# Altium project LaserLider.PrjPcb (part 1 of 3)
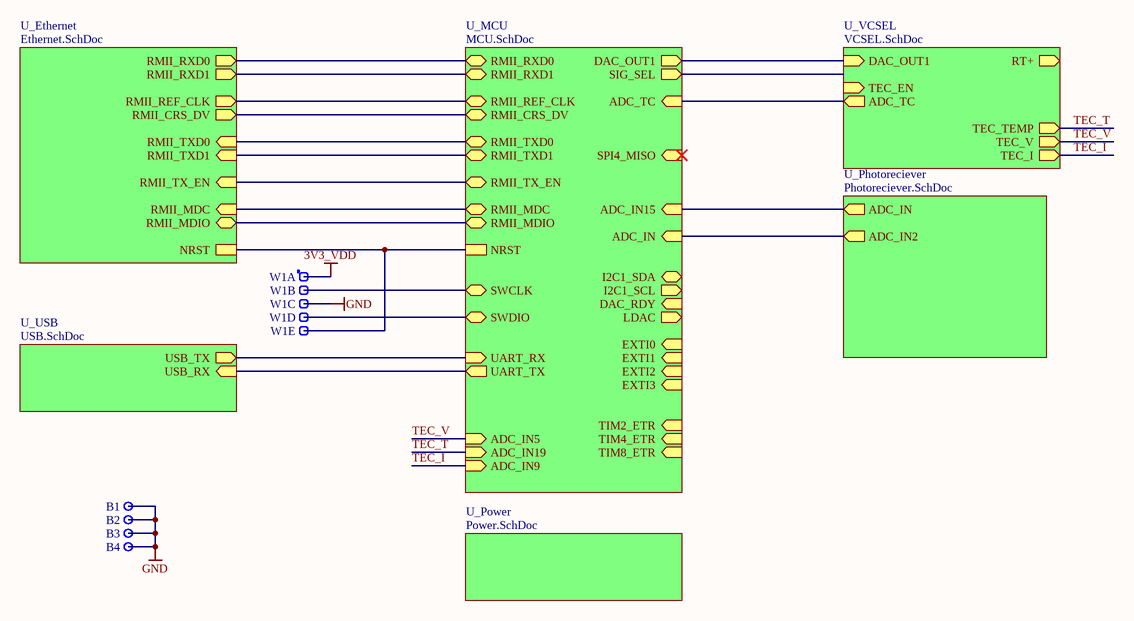
[diagram p0: LaserLider.SchDoc]
8 sheets, 220 parts. Net scope: hierarchical (ports join the sheet entries above them; power ports are global).
Board file: LaserLider.PcbDoc
Sheets:
  LaserLider.SchDoc
    U_MCU = MCU.SchDoc
    U_Ethernet = Ethernet.SchDoc
    U_Power = Power.SchDoc
    U_VCSEL = VCSEL.SchDoc
    U_Photoreciever = Photoreciever.SchDoc
    U_USB = USB.SchDoc
  TEC_controller.SchDoc

## Sheet LaserLider.SchDoc
size A4

### Parts
B1  Plated Hole  [MTG300_600]  (value not drawn)  (no BOM)
B2  Plated Hole  [MTG300_600]  (value not drawn)  (no BOM)
B3  Plated Hole  [MTG300_600]  (value not drawn)  (no BOM)
B4  Plated Hole  [MTG300_600]  (value not drawn)  (no BOM)
W1  Header 5  [SAMTEC_MTLW-105-07-L-S-250]  (value not drawn)  (parts A,B,C,D,E of 5)

### Sub-sheets
U_Ethernet = Ethernet.SchDoc: RMII_TXD0 (in), RMII_TX_EN (in), RMII_RXD0 (out), RMII_REF_CLK (out), RMII_CRS_DV (out), RMII_MDC (in), RMII_MDIO (bidir), NRST, RMII_TXD1 (in), RMII_RXD1 (out)
U_MCU = MCU.SchDoc: SWCLK (bidir), RMII_RXD0 (bidir), RMII_REF_CLK (bidir), RMII_CRS_DV (bidir), RMII_MDC (bidir), RMII_MDIO (bidir), RMII_RXD1 (bidir), SWDIO (bidir), RMII_TXD0 (bidir), RMII_TX_EN (bidir), RMII_TXD1 (bidir), NRST, DAC_OUT1 (out), UART_TX (out), UART_RX (in), ADC_IN (in), ADC_TC (in), SIG_SEL (out), EXTI3 (in), I2C1_SCL (out), I2C1_SDA (bidir), DAC_RDY (in), EXTI1 (in), SPI4_MISO (in), LDAC (out), EXTI2 (in), EXTI0 (in), TIM8_ETR (in), TIM4_ETR (in), TIM2_ETR (in), ADC_IN15 (in), ADC_IN5 (in), ADC_IN19 (in), ADC_IN9 (in)
U_Photoreciever = Photoreciever.SchDoc: ADC_IN (out), ADC_IN2 (out)
U_Power = Power.SchDoc: no entries
U_USB = USB.SchDoc: USB_TX (out), USB_RX (in)
U_VCSEL = VCSEL.SchDoc: DAC_OUT1 (in), ADC_TC (out), RT+ (out), TEC_I (out), TEC_TEMP (out), TEC_V (out), TEC_EN (in)

### Nets
3V3_VDD: W1.1
GND: B1.1 B2.1 B3.1 B4.1 W1.3
ADC_IN: sheet U_MCU/ADC_IN, sheet U_Photoreciever/ADC_IN2
ADC_IN15: sheet U_MCU/ADC_IN15, sheet U_Photoreciever/ADC_IN
ADC_TC: sheet U_MCU/ADC_TC, sheet U_VCSEL/ADC_TC
DAC_OUT: sheet U_MCU/DAC_OUT1, sheet U_VCSEL/DAC_OUT1
NRST: W1.5 ; sheet U_MCU/NRST, sheet U_Ethernet/NRST
RMII_CRS_DV: sheet U_MCU/RMII_CRS_DV, sheet U_Ethernet/RMII_CRS_DV
RMII_MDC: sheet U_MCU/RMII_MDC, sheet U_Ethernet/RMII_MDC
RMII_MDIO: sheet U_MCU/RMII_MDIO, sheet U_Ethernet/RMII_MDIO
RMII_REF_CLK: sheet U_MCU/RMII_REF_CLK, sheet U_Ethernet/RMII_REF_CLK
RMII_RXD0: sheet U_MCU/RMII_RXD0, sheet U_Ethernet/RMII_RXD0
RMII_RXD1: sheet U_MCU/RMII_RXD1, sheet U_Ethernet/RMII_RXD1
RMII_TX_EN: sheet U_MCU/RMII_TX_EN, sheet U_Ethernet/RMII_TX_EN
RMII_TXD0: sheet U_MCU/RMII_TXD0, sheet U_Ethernet/RMII_TXD0
RMII_TXD1: sheet U_MCU/RMII_TXD1, sheet U_Ethernet/RMII_TXD1
SWCLK: W1.2 ; sheet U_MCU/SWCLK
SWDIO: W1.4 ; sheet U_MCU/SWDIO
TEC_I: sheet U_MCU/ADC_IN9, sheet U_VCSEL/TEC_I  [project net ADC_IN9]
TEC_T: sheet U_MCU/ADC_IN19, sheet U_VCSEL/TEC_TEMP  [project net ADC_IN19]
TEC_V: sheet U_MCU/ADC_IN5, sheet U_VCSEL/TEC_V  [project net ADC_IN5]
UART_RX: sheet U_MCU/UART_RX, sheet U_USB/USB_TX
UART_TX: sheet U_MCU/UART_TX, sheet U_USB/USB_RX

### Library data of the parts
B1-B4 = PLATED_HOLE3.0_PAD6.0: Single Terminal Socket; Part Description: Plated Through Hole: Hole Dia.=3.0mm Pad Dia.=6.0mm; Mounted: No; Part Number: PLATED_HOLE3.0_PAD6.0; Component Type: Standard (No BOM); Pin Count: 1; Family: Plated Hole; Socket: No; SMD: No; Sense: No; Status: None; ComponentHeight: 0mm; HelpURL: Undefined; Author: CERN DEM JLC; CreateDate: 26.05.2008; LatestRevisionDate: 26.05.2008; PackageDescription: Plated Through Hole: Hole Dia.=3.0mm Pad Dia.=6.0mm
W1 = SAMTEC_MTLW-105-07-L-S-250: 5 Mini Wire-Wrap Contact Strip Header; Part Description: 5 Contacts, Pitch 2.54mm, Single Row Through Mount Straight Header (Post Lead = 6.35mm, Tail Lead 3.05mm, Insulator 1.52mm); Manufacturer: SAMTEC; PressFit: No; Part Number: SAMTEC_MTLW-105-07-L-S-250; Component Kind: Standard; Component Type: Standard; Pin Count: 5; Family: Header 5; Mounted: Yes; Socket: No; SMD: No; Sense: No; Status: None; Manufacturer Part Number: MTLW-105-07-L-S-250; ComponentHeight: 7.87mm; HelpURL: \\cern.ch\dfs\Applications\Altium\Datasheets\SAMTEC_MTLW-105-07-L-S-250.pdf; Author: CERN DEM JLC; CreateDate: 07.01.2015; LatestRevisionDate: 07.01.2015

## Sheet MCU.SchDoc
size A4
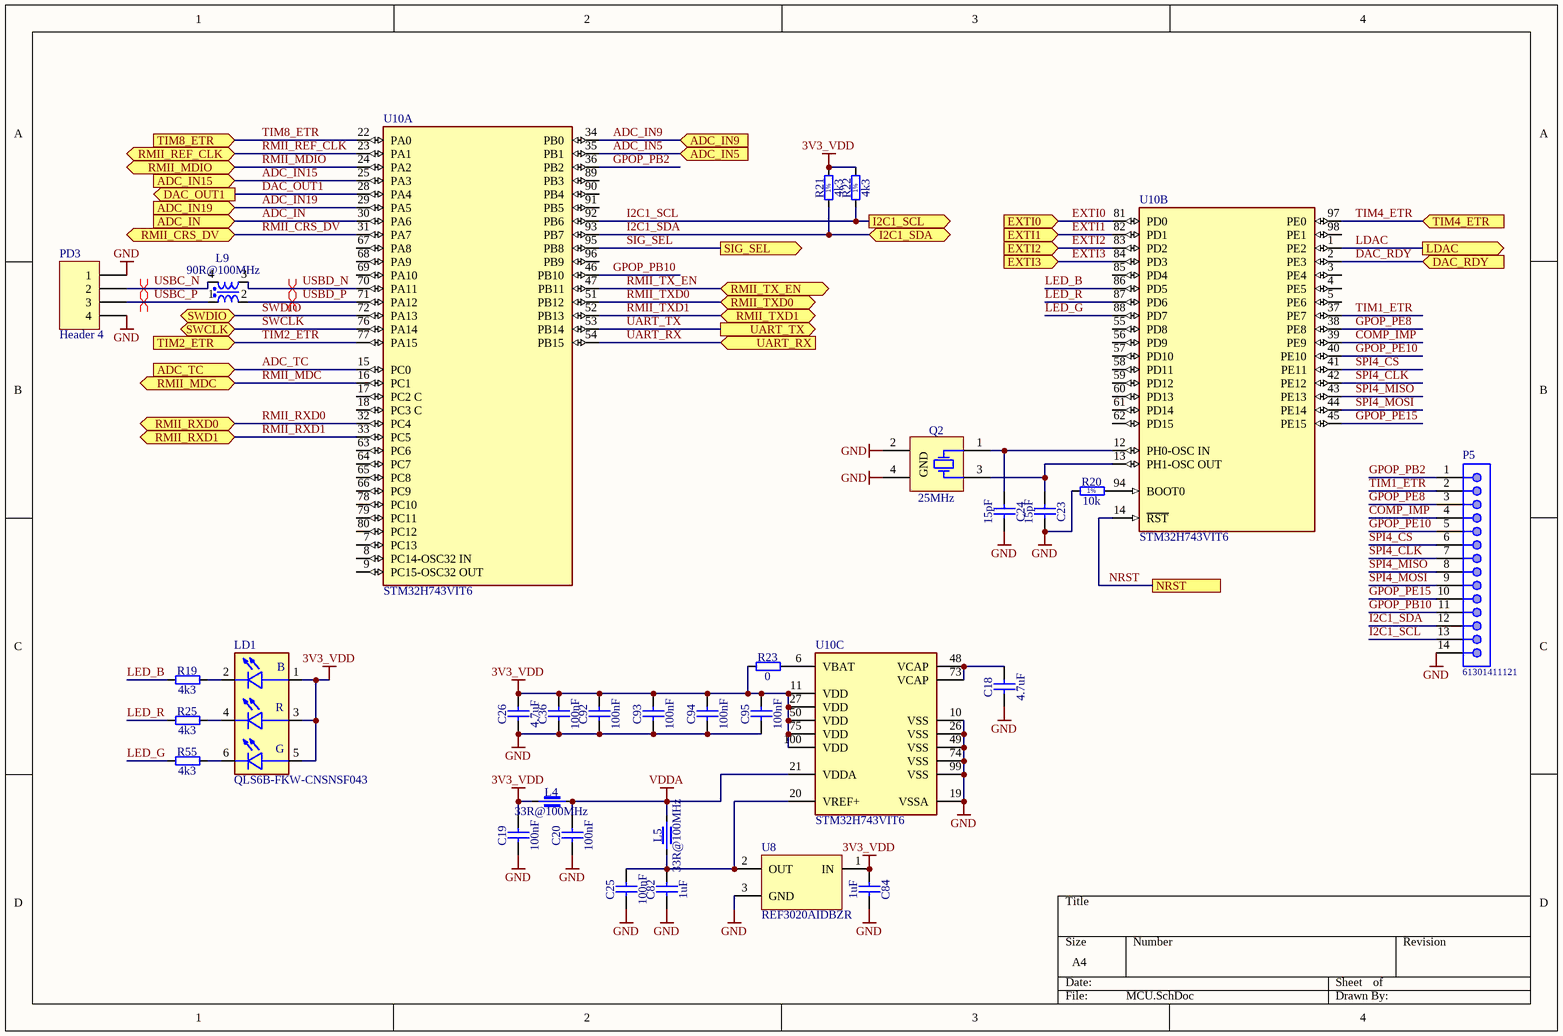
[diagram p1: MCU.SchDoc]

### Parts
C18  4.7uF  [CAPC1709X95N]
C19  100nF  [CAPC1005X55N]
C20  100nF  [CAPC1005X55N]
C23  15pF  [CAPC1005X55N]
C24  15pF  [CAPC1005X55N]
C25  100nF  [CAPC1005X55N]
C26  4.7uF  [CAPC1709X95N]
C36  100nF  [CAPC1005X55N]
C82  1uF  [CAPC1005X55N]
C84  1uF  [CAPC1005X55N]
C92  100nF  [CAPC1005X55N]
C93  100nF  [CAPC1005X55N]
C94  100nF  [CAPC1005X55N]
C95  100nF  [CAPC1005X55N]
L4  33R@100MHz  [INDC1005X55N]
L5  33R@100MHz  [INDC1005X55N]
L9  90R@100MHz  [IND_MURATA_DLW21S]
LD1  QLS6B-FKW-CNSNSF043  [LED_QLS6B-FKW-CNSNSF043]
P5  61301411121  [61301411121]
PD3  Header 4  [HDR1X4]
Q2  25MHz  [XTAL_EPSON_TSX-3225]
R19  4k3  [RESC1005X40N]
R20  10k  [RESC1005X40N]
R21  4k3  [RESC1005X40N]
R22  4k3  [RESC1005X40N]
R23  0  [RESC1005X40N]
R25  4k3  [RESC1005X40N]
R55  4k3  [RESC1005X40N]
U8  REF3020AIDBZR  [DBZ0003A_L]
U10  STM32H743VIT6  [FP-LQFP100-1L-MFG]  (parts A,B,C of 3)

### Ports
ADC_IN5 (in), ADC_IN9 (in), ADC_IN15 (in), ADC_IN19 (in), ADC_IN (in), ADC_TC (in), DAC_OUT1 (out), DAC_RDY (in), EXTI0 (in), EXTI1 (in), EXTI2 (in), EXTI3 (in), I2C1_SCL (out), I2C1_SDA (bidir), LDAC (out), NRST, RMII_CRS_DV (bidir), RMII_MDC (bidir), RMII_MDIO (bidir), RMII_REF_CLK (bidir), RMII_RXD0 (bidir), RMII_RXD1 (bidir), RMII_TX_EN (bidir), RMII_TXD0 (bidir), RMII_TXD1 (bidir), SIG_SEL (out), SWCLK (bidir), SWDIO (bidir), TIM2_ETR (in), TIM4_ETR (in), TIM8_ETR (in), UART_RX (in), UART_TX (out)

### Nets
3V3_VDD: C19.2 C26.2 C36.2 C84.2 C92.2 C93.2 C94.2 C95.2 L4.1 LD1.1(BLUE_ANODE) LD1.3(RED_ANODE) LD1.5(GREEN_ANODE) R21.2 R22.2 R23.1 U8.1(IN) U10.11(VDD) U10.27(VDD) U10.50(VDD) U10.75(VDD) U10.100(VDD)
GND: C18.1 C19.1 C20.1 C23.1 C24.1 C25.1 C26.1 C36.1 C82.1 C84.1 C92.1 C93.1 C94.1 C95.1 P5.14 PD3.1 PD3.4 Q2.2(GND) Q2.4(GND) R20.1 U8.3(GND) U10.10(VSS) U10.19(VSSA) U10.26(VSS) U10.49(VSS) U10.74(VSS) U10.99(VSS)
VDDA: C20.2 L4.2 L5.2 U10.21(VDDA)
ADC_IN: U10.30(PA6) ; port ADC_IN
ADC_IN5: U10.35(PB1) ; port ADC_IN5
ADC_IN9: U10.34(PB0) ; port ADC_IN9
ADC_IN15: U10.25(PA3) ; port ADC_IN15
ADC_IN19: U10.29(PA5) ; port ADC_IN19
ADC_TC: U10.15(PC0) ; port ADC_TC
COMP_IMP: P5.4 U10.39(PE9)
DAC_OUT1: U10.28(PA4) ; port DAC_OUT1  [project net DAC_OUT]
DAC_RDY: U10.2(PE3) ; port DAC_RDY
EXTI0: U10.81(PD0) ; port EXTI0
EXTI1: U10.82(PD1) ; port EXTI1
EXTI2: U10.83(PD2) ; port EXTI2
EXTI3: U10.84(PD3) ; port EXTI3
GPOP_PB2: P5.1 U10.36(PB2)
GPOP_PB10: P5.11 U10.46(PB10)
GPOP_PE8: P5.3 U10.38(PE8)
GPOP_PE10: P5.5 U10.40(PE10)
GPOP_PE15: P5.10 U10.45(PE15)
I2C1_SCL: P5.13 R22.1 U10.92(PB6) ; port I2C1_SCL
I2C1_SDA: P5.12 R21.1 U10.93(PB7) ; port I2C1_SDA
LDAC: U10.1(PE2) ; port LDAC
LED_B: R19.1 U10.86(PD5)
LED_G: R55.1 U10.88(PD7)
LED_R: R25.1 U10.87(PD6)
NRST: U10.14(~{RST}) ; port NRST
RMII_CRS_DV: U10.31(PA7) ; port RMII_CRS_DV
RMII_MDC: U10.16(PC1) ; port RMII_MDC
RMII_MDIO: U10.24(PA2) ; port RMII_MDIO
RMII_REF_CLK: U10.23(PA1) ; port RMII_REF_CLK
RMII_RXD0: U10.32(PC4) ; port RMII_RXD0
RMII_RXD1: U10.33(PC5) ; port RMII_RXD1
RMII_TX_EN: U10.47(PB11) ; port RMII_TX_EN
RMII_TXD0: U10.51(PB12) ; port RMII_TXD0
RMII_TXD1: U10.52(PB13) ; port RMII_TXD1
SIG_SEL: U10.95(PB8) ; port SIG_SEL
SPI4_CLK: P5.7 U10.42(PE12)
SPI4_CS: P5.6 U10.41(PE11)
SPI4_MISO: P5.8 U10.43(PE13)
SPI4_MOSI: P5.9 U10.44(PE14)
SWCLK: U10.76(PA14) ; port SWCLK
SWDIO: U10.72(PA13) ; port SWDIO
TIM1_ETR: P5.2 U10.37(PE7)
TIM2_ETR: U10.77(PA15) ; port TIM2_ETR
TIM4_ETR: U10.97(PE0) ; port TIM4_ETR
TIM8_ETR: U10.22(PA0) ; port TIM8_ETR
UART_RX: U10.54(PB15) ; port UART_RX
UART_TX: U10.53(PB14) ; port UART_TX
USBC_N: L9.4 PD3.2
USBC_P: L9.1 PD3.3
USBD_N: L9.3 U10.70(PA11)
USBD_P: L9.2 U10.71(PA12)
NetC18_2: C18.2 U10.48(VCAP) U10.73(VCAP)
NetC23_2: C23.2 Q2.3(X) U10.13(PH1-OSC_OUT)
NetC24_2: C24.2 Q2.1(X) U10.12(PH0-OSC_IN)
NetC25_2: C25.2 C82.2 L5.1 U8.2(OUT) U10.20(VREF+)
NetLD1_2: LD1.2(BLUE_CATHODE) R19.2
NetLD1_4: LD1.4(RED_CATHODE) R25.2
NetLD1_6: LD1.6(GREEN_CATHODE) R55.2
NetR20_2: R20.2 U10.94(BOOT0)
NetR23_2: R23.2 U10.6(VBAT)

Not connected (* = marked no-connect by the designer): U10 3(PE4) 4(PE5) 5(PE6) 7(PC13) 8(PC14-OSC32_IN) 9(PC15-OSC32_OUT) 17(PC2_C) 18(PC3_C) 55(PD8) 56(PD9) 57(PD10) 58(PD11) 59(PD12) 60(PD13) 61(PD14) 62(PD15) 63(PC6) 64(PC7) 65(PC8) 66(PC9) 67(PA8) 68(PA9) 69(PA10) 78(PC10) 79(PC11) 80(PC12) 85(PD4) 89(PB3) 90(PB4) 91(PB5) 96(PB9) 98(PE1)

### Layout directives
differential pair: USBC_N, USBC_P, USBD_N, USBD_P

### Notes on the sheet
- (in symbol QLS6B-FKW-CNSNSF043) B; R; G
- (in symbol R0402_4K3_1%_0.0625W_100PPM) 1%
- (in symbol R0402_10K_1%_0.0625W_100PPM) 1%

### Library data of the parts
C18 C26 = CC0603_4.7UF_16V_10%_X5R: Non-polarised capacitor; Part Description: SMD Multilayer Chip Ceramic Capacitor; Manufacturer: GENERIC; Manufacturer1 Part Number: EMK107ABJ475KA-T; Voltage: 16V; TC: X5R; Tolerance: ±10%; Part Number: CC0603_4.7UF_16V_10%_X5R; Component Kind: Standard; Component Type: Standard; Pin Count: 2; Value: 4.7uF; Status: None; Manufacturer Part Number: CC0603_4.7UF_16V_10%_X5R; Case: 0603; Mounted: Yes; Socket: No; SMD: Yes; Sense: No; Manufacturer1 Example: TAIYO YUDEN; Manufacturer1 ComponentHeight: 0.95mm; HelpURL: \\cern.ch\dfs\Applications\Altium\Datasheets\CC0603_X7R_TAIYO-YUDEN_HIGH-VALUE.pdf; Author: CERN DEM JLC; CreateDate: 16.12.2013; LatestRevisionDate: 16.09.2014
C19 C20 C25 C36 C92-C95 = CC0402_100NF_16V_10%_X7R: Non-polarised capacitor; Part Description: SMD Multilayer Chip Ceramic Capacitor; Manufacturer: GENERIC; Manufacturer1 Part Number: GRM155R71C104KA88D; Voltage: 16V; TC: X7R; Tolerance: ±10%; Part Number: CC0402_100NF_16V_10%_X7R; Component Kind: Standard; Component Type: Standard; Pin Count: 2; Value: 100nF; Status: Not Recommended; Manufacturer Part Number: CC0402_100NF_16V_10%_X7R; Case: 0402; Mounted: Yes; Socket: No; SMD: Yes; Sense: No; Manufacturer1 Example: MURATA; Manufacturer1 ComponentHeight: 0.55mm; HelpURL: \\cern.ch\dfs\Applications\Altium\Datasheets\CC0402_X7R_MURATA_GRM.pdf; Author: CERN DEM JLC; CreateDate: 05.12.2013; LatestRevisionDate: 03.12.2007
C23 C24 = CC0402_15PF_50V_5%_C0G: Non-polarised capacitor; Part Description: SMD Multilayer Chip Ceramic Capacitor; Manufacturer: GENERIC; Manufacturer1 Part Number: C0402C150J5GACTU; Voltage: 50V; TC: C0G/NP0; Tolerance: ±5%; Part Number: CC0402_15PF_50V_5%_C0G; Component Kind: Standard; Component Type: Standard; Pin Count: 2; Value: 15pF; Status: Preferred; Manufacturer Part Number: CC0402_15PF_50V_5%_C0G; Case: 0402; Mounted: Yes; Socket: No; SMD: Yes; Sense: No; Manufacturer1 Example: KEMET; Manufacturer1 ComponentHeight: 0.55mm; HelpURL: \\cern.ch\dfs\Applications\Altium\Datasheets\CC0402_C0G_KEMET_(Commercial Grade).pdf; Author: CERN DEM JLC; CreateDate: 03.12.2007; LatestRevisionDate: 22.04.2015
C82 C84 = CC0402_1UF_16V_10%_X5R: Non-polarised capacitor; Part Description: SMD Multilayer Chip Ceramic Capacitor; Manufacturer: GENERIC; Manufacturer1 Part Number: C1005X5R1C105KT; Voltage: 16V; TC: X5R; Tolerance: ±10%; Part Number: CC0402_1UF_16V_10%_X5R; Component Kind: Standard; Component Type: Standard; Pin Count: 2; Value: 1uF; Status: Preferred; Manufacturer Part Number: CC0402_1UF_16V_10%_X5R; Case: 0402; Mounted: Yes; Socket: No; SMD: Yes; Sense: No; Manufacturer1 Example: TDK; Manufacturer1 ComponentHeight: 0.55mm; HelpURL: \\cern.ch\dfs\Applications\Altium\Datasheets\CC0402_X5R_TDK_C.pdf; Author: CERN DEM JLC; CreateDate: 25.10.2012; LatestRevisionDate: 25.10.2012
L4 L5 = IND0402_MURATA_BLM15PX330SN1D: Part Description: SMD EMIFIL Chip Ferrite Bead; Manufacturer: MURATA; Power: 3A; Resistance: 0.022R; Tolerance: ±25%; Part Number: IND0402_MURATA_BLM15PX330SN1D; Component Kind: Standard; Component Type: Standard; Pin Count: 2; Value: 33R@100MHz; Status: None; Manufacturer Part Number: BLM15PX330SN1D; Case: 0402; Mounted: Yes; Socket: No; SMD: Yes; Sense: No; ComponentHeight: 0.55mm; HelpURL: \\cern.ch\dfs\Applications\Altium\Datasheets\IND0402_MURATA_BLM15PX.pdf; Author: CERN DEM JMW; CreateDate: 19.02.2014; LatestRevisionDate: 25.10.2018
L9 = IND_MURATA_DLW21SN900SQ2L: Inductor Common Mode; Part Description: Wire Wound Common Mode Choke Coil (DLW21S Series); Manufacturer: MURATA; Power: 330mA; Resistance: 0.35R; Tolerance: ±25%; Part Number: IND_MURATA_DLW21SN900SQ2L; Component Kind: Standard; Component Type: Standard; Pin Count: 4; Value: 90R@100MHz; Status: None; Manufacturer Part Number: DLW21SN900SQ2L; Case: 0805; Mounted: Yes; Socket: No; SMD: Yes; Sense: No; ComponentHeight: 1.4mm; HelpURL: \\cern.ch\dfs\Applications\Altium\Datasheets\IND_MURATA_DLW21S.pdf; Author: CERN DEM JLC; CreateDate: 01.07.2014; LatestRevisionDate: 01.07.2014
LD1 = QLS6B-FKW-CNSNSF043: Red, Green, Blue _RGB_ 622nm Red, 530nm Green, 470nm Blue LED Indication - Discrete 2.1V Red, 3V Green, 3.1V Blue 6-SMD, J-Lead; MF: Cree Inc.; MP: QLS6B-FKW-CNSNSF043; Package: SMD-6 Cree; Availability: Unavailable; Price: None; SnapEDA_Link: https://www.snapeda.com/parts/QLS6B-FKW-CNSNSF043/Cree%20Inc./view-part/596834/?ref=snap; Value: *
P5 = 61301411121: WR-PHD Pin Header, THT, pitch 2.54mm, Single Row, Vertical, 14p; Manufacturer: Wurth Elektronik; Pin Number: 14; Rated Current: 3A; Working Voltage: 250VAC; Withstanding Voltage: 500VAC; Contact Resistance: 20mOhm; ComponentLink1Description: Manufacturer; ComponentLink1URL: http://www.we-online.de; ComponentLink2Description: Datasheet; ComponentLink2URL: https://www.we-online.com/catalog/datasheet/61301411121.pdf; Manufacturer Part Number: 61301411121; Published Date: May 2020; Pitch: 2.54mm; Operating Temperature: -40 to +105degC; Mounting Technology: THT; Packaging: Bag; Gender: Pin Header; Row Number: Single; Orientation: Vertical
PD3 = Header 4: Header, 4-Pin; LatestRevisionDate: 17-Jul-2002; LatestRevisionNote: Re-released for DXP Platform.; Publisher: Altium Limited
Q2 = XTAL_25MHZ_EPSON_TSX-3225 25.0000MF10Z-AC: Crystal 4 pins 1=XTAL Control 2=GND3=XTAL 4=GND; Part Description: Tolerance ± 10 ppm,  Stability:± 10ppm, -20°C to 75°C, 9pF, Surface Mount Quartz Crystal, TX-3225 Series; Manufacturer: EPSON; PressFit: No; Bonding: No; Part Number: XTAL_25MHZ_EPSON_TSX-3225 25.0000MF10Z-AC; Component Kind: Standard; Component Type: Standard; PackageDescription: Crystal TSX-3225 Serie, Corner Concave; 4 pin, 2.50mm L X 3.2mm W X 0.6mm H; Value: 25MHz; Manufacturer Part Number: TSX-3225 25.0000MF10Z-AC; Pin Count: 4; Mounted: Yes; Socket: No; SMD: Yes; Sense: No; ComponentHeight: 0.6mm; HelpURL: \\cern.ch\dfs\Applications\Altium\Datasheets\XTAL_EPSON_TSX-3225.pdf; ComponentLink1URL: \\cern.ch\dfs\Applications\Altium\Datasheets\XTAL_EPSON_TSX-3225_Ordering-Informations.pdf; ComponentLink1Description: Ordering Informations; Author: CERN DEM JLC; CreateDate: 03.04.2012; LatestRevisionDate: 06.10.2016
R19 R21 R22 R25 R55 = R0402_4K3_1%_0.0625W_100PPM: Resistor - 1%; Part Description: General Purpose Thick Film Chip Resistor; Manufacturer: GENERIC; Manufacturer1 Part Number: 232270674302L; TC: ±100ppm/°C; PressFit: No; Part Number: R0402_4K3_1%_0.0625W_100PPM; Component Kind: Standard; Component Type: Standard; Pin Count: 2; Value: 4k3; Status: Not Recommended; Power: 0.0625W; Tolerance: ±1%; Manufacturer Part Number: R0402_4K3_1%_0.0625W_100PPM; Case: 0402; Mounted: Yes; Sense: No; Socket: No; SMD: Yes; Manufacturer1 Example: YAGEO PHYCOMP; Manufacturer1 ComponentHeight: 0.4mm; HelpURL: \\cern.ch\dfs\Applications\Altium\Datasheets\R0402_Phycomp_RC0402.pdf; Author: CERN DEM JLC; CreateDate: 03.12.2007; LatestRevisionDate: 17.10.2012
R20 = R0402_10K_1%_0.0625W_100PPM: Resistor - 1%; Part Description: General Purpose Thick Film Chip Resistor; Manufacturer: GENERIC; Manufacturer1 Part Number: 232270671003L; TC: ±100ppm/°C; PressFit: No; Part Number: R0402_10K_1%_0.0625W_100PPM; Component Kind: Standard; Component Type: Standard; Pin Count: 2; Value: 10k; Status: Not Recommended; Power: 0.0625W; Tolerance: ±1%; Manufacturer Part Number: R0402_10K_1%_0.0625W_100PPM; Case: 0402; Mounted: Yes; Sense: No; Socket: No; SMD: Yes; Manufacturer1 Example: YAGEO PHYCOMP; Manufacturer1 ComponentHeight: 0.4mm; HelpURL: \\cern.ch\dfs\Applications\Altium\Datasheets\R0402_Phycomp_RC0402.pdf; Author: CERN DEM JLC; CreateDate: 03.12.2007; LatestRevisionDate: 17.10.2012
R23 = R0402_0R_JUMPER: Resistor; Part Description: 1A (0.05R Max DC Resistance) Zero Ohm Jumper; Manufacturer: GENERIC; Manufacturer1 Part Number: 232270591001L; PressFit: No; Part Number: R0402_0R_JUMPER; Component Kind: Standard; Component Type: Standard; Pin Count: 2; Value: 0; Status: Not Recommended; Manufacturer Part Number: R0402_0R_JUMPER; Case: 0402; Mounted: Yes; Sense: No; Socket: No; SMD: Yes; Manufacturer1 Example: YAGEO PHYCOMP; Manufacturer1 ComponentHeight: 0.4mm; HelpURL: \\cern.ch\dfs\Applications\Altium\Datasheets\R0402_Phycomp_RC0402.pdf; Author: CERN DEM JLC; CreateDate: 03.12.2007; LatestRevisionDate: 17.10.2012
U8 = CMP-0367-00156-2: 2.048 V, 50 ppm / degC, 50 uA Series (Bandgap) Voltage Reference, -40 to 125 degC, 3-pin SOT-23 (DBZ), Green (RoHS & no Sb/Br); Manufacturer: Texas Instruments; Temp Coeff(Max)(ppm/ degree C): 50; Initial Accuracy @ 25/deg C(%): 0.2; VI(Min)(V): 2.049; VI(Max)(V): 5.5; Temp Coeff(Typ)(ppm/ degree C): 20; SubFamily: Series Voltage Reference; Rating: Catalog; VO(V): 2.048; PartNumber: REF3020AIDBZR; Eco-Plan: Green (RoHS & no Sb/Br); ComponentLink1Description: Manufacturer URL; ComponentLink2URL: http://www.ti.com/general/docs/lit/getliterature.tsp?genericPartNumber=REF3020&fileType=pdf; PackageDescription: 3-Pin Plastic Small Outline, Body 2.92 x 1.3 mm, Pitch 0.95 mm; Code_JEDEC: TO-236; ComponentLink2Description: Datasheet; DatasheetVersion: SBVS032F; ComponentLink3Description: Package Specification; ComponentLink3URL: http://www.ti.com/litv/pdf/mpds108a; ComponentLink1URL: http://www.ti.com/; Iq(Max)(uA): 50; Mounting Technology: Surface Mount; PackageVersion: 4203227/B; PackageReference: DBZ0003A
U10 = CMP-12105-000050-1: IC MCU 32BIT 2MB FLASH 100LQFP; Manufacturer: STMicroelectronics; Number Of Ethernet Channels: 1; Number Of Usb Channels: 2; Number Of A/D Converters: 3; Min Supply Voltage: 1.71V; Ram Size: 1060KBytes; Number Of I2C Channels: 4; Frequency: 480MHz; Number Of Adc Channels: 36; Number Of I/Os: 82; Max Supply Voltage: 3.6V; Number Of Spi Channels: 6; Memory Size: 2MBytes; Max Junction Temp: +125°C; Core Architecture: Arm Cortex-M7; Interface: I2C,SPI,UART,USART,USB,LIN,IrDA,Ethernet,I2S,Other; Number Of Timers/Counters: 20; Data Bus Width: 32bits; Number Of Pwm Channels: 42; Number Of Uart Channels: 9; Standoff Height: 0.05mm; Device Class L1: Integrated Circuits (ICs); ComponentLink2URL: https://www.st.com/resource/en/datasheet/stm32h743vi.pdf; Automotive: No; Memory Type: FLASH; Number Of Cores: 1; Temperature Range Low: -40°C; RoHS: TRUE; Ambient Temperature Range Low: -40°C; ComponentLink2Description: Datasheet; Device Class L2: Embedded Processors and Controllers; Device Class L3: Microcontrollers; Digikey Description: IC MCU 32BIT 2MB FLASH 100LQFP; Temperature Range High: +125°C; Ambient Temperature Range High: +85°C; Package: LQFP100-1L; Temperature: -40°C to +125°C; Category: IC; Ipc Land Pattern Name: QFP50P1600X1600X160-100; Height: 1.6mm; Manufacturer Part Number: STM32H743VIT6; Octopart: https://octopart.com/stm32h743vit6-stmicroelectronics-76372527; Lead Free: Yes

## Sheet Ethernet.SchDoc
size A4
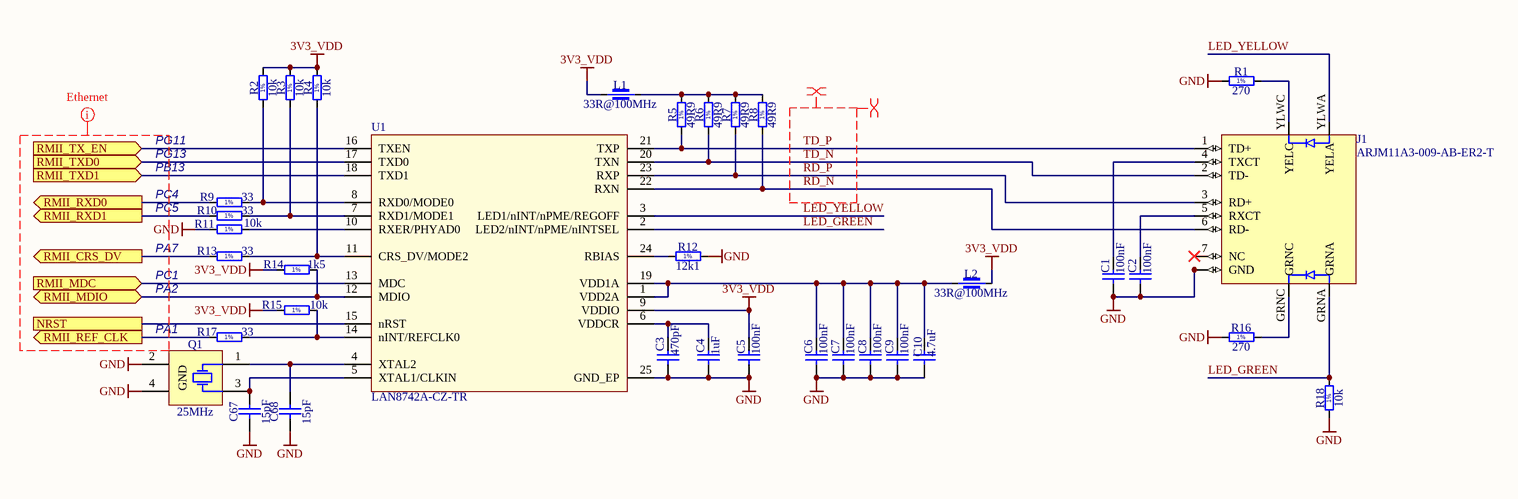
[diagram p2: Ethernet.SchDoc]

### Parts
C1  100nF  [CAPC1005X55N]
C2  100nF  [CAPC1005X55N]
C3  470pF  [CAPC1005X55N]
C4  1uF  [CAPC1005X55N]
C5  100nF  [CAPC1005X55N]
C6  100nF  [CAPC1005X55N]
C7  100nF  [CAPC1005X55N]
C8  100nF  [CAPC1005X55N]
C9  100nF  [CAPC1005X55N]
C10  4.7uF  [CAPC1709X95N]
C67  15pF  [CAPC1005X55N]
C68  15pF  [CAPC1005X55N]
J1  ARJM11A3-009-AB-ER2-T  [ARJM11A3-009-AB-ER2-T]
L1  33R@100MHz  [INDC1005X55N]
L2  33R@100MHz  [INDC1005X55N]
Q1  25MHz  [XTAL_EPSON_TSX-3225]
R1  270  [RESC1005X40N]
R2  10k  [RESC1005X40N]
R3  10k  [RESC1005X40N]
R4  10k  [RESC1005X40N]
R5  49R9  [RESC1005X40N]
R6  49R9  [RESC1005X40N]
R7  49R9  [RESC1005X40N]
R8  49R9  [RESC1005X40N]
R9  33  [RESC1005X40N]
R10  33  [RESC1005X40N]
R11  10k  [RESC1005X40N]
R12  12k1  [RESC1005X40N]
R13  33  [RESC1005X40N]
R14  1k5  [RESC1005X40N]
R15  10k  [RESC1005X40N]
R16  270  [RESC1005X40N]
R17  33  [RESC1005X40N]
R18  10k  [RESC1005X40N]
U1  LAN8742A-CZ-TR  [QFN24_0R5_4X4]

### Ports
NRST, RMII_CRS_DV (out), RMII_MDC (in), RMII_MDIO (bidir), RMII_REF_CLK (out), RMII_RXD0 (out), RMII_RXD1 (out), RMII_TX_EN (in), RMII_TXD0 (in), RMII_TXD1 (in)

### Nets
3V3_VDD: C5.2 L1.1 L2.2 R2.2 R3.2 R4.2 R14.1 R15.1 U1.9(VDDIO)
GND: C1.1 C2.1 C3.1 C4.1 C5.1 C6.1 C7.1 C8.1 C9.1 C10.1 C67.1 C68.1 J1.8(GND) J1.P$3(GND) J1.P$4(GND) Q1.2(GND) Q1.4(GND) R1.1 R11.1 R12.2 R16.1 R18.1 U1.25(GND_EP)
LED_GREEN: J1.GRNA R18.2 U1.2(LED2/nINT/nPME/nINTSEL)
LED_YELLOW: J1.YLWA(YELA) U1.3(LED1/nINT/nPME/REGOFF)
NRST: U1.15(nRST) ; port NRST
RD_N: J1.6(RD-) R8.1 U1.22(RXN)
RD_P: J1.3(RD+) R7.1 U1.23(RXP)
RMII_CRS_DV: R13.1 ; port RMII_CRS_DV
RMII_MDC: U1.13(MDC) ; port RMII_MDC
RMII_MDIO: R14.2 U1.12(MDIO) ; port RMII_MDIO
RMII_REF_CLK: R17.1 ; port RMII_REF_CLK
RMII_RXD0: R9.1 ; port RMII_RXD0
RMII_RXD1: R10.1 ; port RMII_RXD1
RMII_TX_EN: U1.16(TXEN) ; port RMII_TX_EN
RMII_TXD0: U1.17(TXD0) ; port RMII_TXD0
RMII_TXD1: U1.18(TXD1) ; port RMII_TXD1
TD_N: J1.2(TD-) R6.1 U1.20(TXN)
TD_P: J1.1(TD+) R5.1 U1.21(TXP)
NetC1_2: C1.2 J1.4(TXCT)
NetC2_2: C2.2 J1.5(RXCT)
NetC3_2: C3.2 C4.2 U1.6(VDDCR)
NetC6_2: C6.2 C7.2 C8.2 C9.2 C10.2 L2.1 U1.1(VDD2A) U1.19(VDD1A)
NetC67_2: C67.2 Q1.3(X) U1.5(XTAL1/CLKIN)
NetC68_2: C68.2 Q1.1(X) U1.4(XTAL2)
NetJ1_GRNC: J1.GRNC R16.2
NetJ1_YLWC: J1.YLWC(YELC) R1.2
NetL1_2: L1.2 R5.2 R6.2 R7.2 R8.2
NetR2_1: R2.1 R9.2 U1.8(RXD0/MODE0)
NetR3_1: R3.1 R10.2 U1.7(RXD1/MODE1)
NetR4_1: R4.1 R13.2 U1.11(CRS_DV/MODE2)
NetR11_2: R11.2 U1.10(RXER/PHYAD0)
NetR12_1: R12.1 U1.24(RBIAS)
NetR15_2: R15.2 R17.2 U1.14(nINT/REFCLK0)

Not connected (* = marked no-connect by the designer): J1 7(NC)*

### Layout directives
differential pair: RD_N, RD_P, TD_N, TD_P
net class DIFFPAIR: RD_N, RD_P, TD_N, TD_P
net class Ethernet: (no net found under the mark)

### Notes on the sheet
- PG11
- PG13
- PB13
- PC4
- PC5
- PA7
- PC1
- PA2
- PA1
- (in symbol R0402_1K5_1%_0.0625W_100PPM) 1%
- (in symbol R0402_10K_1%_0.0625W_100PPM) 1%
- (in symbol R0402_12K1_1%_0.0625W_100PPM) 1%
- (in symbol R0402_33R_1%_0.0625W_100PPM) 1%
- (in symbol R0402_49R9_1%_0.0625W_100PPM) 1%
- (in symbol R0402_270R_1%_0.0625W_100PPM) 1%

### Library data of the parts
C1 C2 C5-C9 = CC0402_100NF_16V_10%_X7R: as C19 on sheet MCU; Part Number: CC0402_100NF_16V_10%_X7R; Component Kind: Standard; Component Type: Standard; Pin Count: 2; Value: 100nF; Status: Not Recommended; Manufacturer Part Number: CC0402_100NF_16V_10%_X7R; Case: 0402; Mounted: Yes; Socket: No; SMD: Yes; Sense: No; Manufacturer1 Example: MURATA; Manufacturer1 ComponentHeight: 0.55mm; HelpURL: \\cern.ch\dfs\Applications\Altium\Datasheets\CC0402_X7R_MURATA_GRM.pdf; Author: CERN DEM JLC; CreateDate: 05.12.2013; LatestRevisionDate: 03.12.2007
C3 = CC0402_470PF_50V_10%_X7R: Non-polarised capacitor; Part Description: SMD Multilayer Chip Ceramic Capacitor; Manufacturer: GENERIC; Manufacturer1 Part Number: 223858715618; Voltage: 50V; TC: X7R; Tolerance: ±10%; Part Number: CC0402_470PF_50V_10%_X7R; Component Kind: Standard; Component Type: Standard; Pin Count: 2; Value: 470pF; Status: Not Recommended; Manufacturer Part Number: CC0402_470PF_50V_10%_X7R; Case: 0402; Mounted: Yes; Socket: No; SMD: Yes; Sense: No; Manufacturer1 Example: PHYCOMP; Manufacturer1 ComponentHeight: 0.55mm; HelpURL: \\cern.ch\dfs\Applications\Altium\Datasheets\CC0402_NP0_PHYCOMP.pdf; Author: CERN DEM JLC; CreateDate: 03.12.2007; LatestRevisionDate: 03.12.2007
C4 = CC0402_1UF_16V_10%_X5R: as C82 on sheet MCU; Part Number: CC0402_1UF_16V_10%_X5R; Component Kind: Standard; Component Type: Standard; Pin Count: 2; Value: 1uF; Status: Preferred; Manufacturer Part Number: CC0402_1UF_16V_10%_X5R; Case: 0402; Mounted: Yes; Socket: No; SMD: Yes; Sense: No; Manufacturer1 Example: TDK; Manufacturer1 ComponentHeight: 0.55mm; HelpURL: \\cern.ch\dfs\Applications\Altium\Datasheets\CC0402_X5R_TDK_C.pdf; Author: CERN DEM JLC; CreateDate: 25.10.2012; LatestRevisionDate: 25.10.2012
C10 = CC0603_4.7UF_16V_10%_X5R: as C18 on sheet MCU; Part Number: CC0603_4.7UF_16V_10%_X5R; Component Kind: Standard; Component Type: Standard; Pin Count: 2; Value: 4.7uF; Status: None; Manufacturer Part Number: CC0603_4.7UF_16V_10%_X5R; Case: 0603; Mounted: Yes; Socket: No; SMD: Yes; Sense: No; Manufacturer1 Example: TAIYO YUDEN; Manufacturer1 ComponentHeight: 0.95mm; HelpURL: \\cern.ch\dfs\Applications\Altium\Datasheets\CC0603_X7R_TAIYO-YUDEN_HIGH-VALUE.pdf; Author: CERN DEM JLC; CreateDate: 16.12.2013; LatestRevisionDate: 16.09.2014
C67 C68 = CC0402_15PF_50V_5%_C0G: as C23 on sheet MCU; Part Number: CC0402_15PF_50V_5%_C0G; Component Kind: Standard; Component Type: Standard; Pin Count: 2; Value: 15pF; Status: Preferred; Manufacturer Part Number: CC0402_15PF_50V_5%_C0G; Case: 0402; Mounted: Yes; Socket: No; SMD: Yes; Sense: No; Manufacturer1 Example: KEMET; Manufacturer1 ComponentHeight: 0.55mm; HelpURL: \\cern.ch\dfs\Applications\Altium\Datasheets\CC0402_C0G_KEMET_(Commercial Grade).pdf; Author: CERN DEM JLC; CreateDate: 03.12.2007; LatestRevisionDate: 22.04.2015
J1 = ARJM11A3-009-AB-ER2-T: 1 Port RJ45 Magjack Connector Through Hole 10/100 Base-T, AutoMDIX; MF: Abracon LLC; Purchase-URL: https://pricing.snapeda.com/search/part/ARJM11A3-009-AB-ER2-T/?ref=eda; SnapEDA_Link: https://www.snapeda.com/parts/ARJM11A3-009-AB-ER2-T/Abracon%20LLC/view-part/4629788/?ref=snap; Availability: Warning; Price: None; MP: ARJM11A3-009-AB-ER2-T; Check_prices: https://www.snapeda.com/parts/ARJM11A3-009-AB-ER2-T/Abracon%20LLC/view-part/4629788/?ref=eda; Package: None; Value: *
L1 L2 = IND0402_MURATA_BLM15PX330SN1D: as L4 on sheet MCU; Part Number: IND0402_MURATA_BLM15PX330SN1D; Component Kind: Standard; Component Type: Standard; Pin Count: 2; Value: 33R@100MHz; Status: None; Manufacturer Part Number: BLM15PX330SN1D; Case: 0402; Mounted: Yes; Socket: No; SMD: Yes; Sense: No; ComponentHeight: 0.55mm; HelpURL: \\cern.ch\dfs\Applications\Altium\Datasheets\IND0402_MURATA_BLM15PX.pdf; Author: CERN DEM JMW; CreateDate: 19.02.2014; LatestRevisionDate: 25.10.2018
Q1 = XTAL_25MHZ_EPSON_TSX-3225 25.0000MF10Z-AC: as Q2 on sheet MCU; Part Number: XTAL_25MHZ_EPSON_TSX-3225 25.0000MF10Z-AC; Component Kind: Standard; Component Type: Standard; PackageDescription: Crystal TSX-3225 Serie, Corner Concave; 4 pin, 2.50mm L X 3.2mm W X 0.6mm H; Value: 25MHz; Manufacturer Part Number: TSX-3225 25.0000MF10Z-AC; Pin Count: 4; Mounted: Yes; Socket: No; SMD: Yes; Sense: No; ComponentHeight: 0.6mm; HelpURL: \\cern.ch\dfs\Applications\Altium\Datasheets\XTAL_EPSON_TSX-3225.pdf; ComponentLink1URL: \\cern.ch\dfs\Applications\Altium\Datasheets\XTAL_EPSON_TSX-3225_Ordering-Informations.pdf; ComponentLink1Description: Ordering Informations; Author: CERN DEM JLC; CreateDate: 03.04.2012; LatestRevisionDate: 06.10.2016
R1 R16 = R0402_270R_1%_0.0625W_100PPM: Resistor - 1%; Part Description: General Purpose Thick Film Chip Resistor; Manufacturer: GENERIC; Manufacturer1 Part Number: 232270672701L; TC: ±100ppm/°C; PressFit: No; Part Number: R0402_270R_1%_0.0625W_100PPM; Component Kind: Standard; Component Type: Standard; Pin Count: 2; Value: 270; Status: Not Recommended; Power: 0.0625W; Tolerance: ±1%; Manufacturer Part Number: R0402_270R_1%_0.0625W_100PPM; Case: 0402; Mounted: Yes; Sense: No; Socket: No; SMD: Yes; Manufacturer1 Example: YAGEO PHYCOMP; Manufacturer1 ComponentHeight: 0.4mm; HelpURL: \\cern.ch\dfs\Applications\Altium\Datasheets\R0402_Phycomp_RC0402.pdf; Author: CERN DEM JLC; CreateDate: 03.12.2007; LatestRevisionDate: 17.10.2012
R2-R4 R11 R15 R18 = R0402_10K_1%_0.0625W_100PPM: as R20 on sheet MCU; Part Number: R0402_10K_1%_0.0625W_100PPM; Component Kind: Standard; Component Type: Standard; Pin Count: 2; Value: 10k; Status: Not Recommended; Power: 0.0625W; Tolerance: ±1%; Manufacturer Part Number: R0402_10K_1%_0.0625W_100PPM; Case: 0402; Mounted: Yes; Sense: No; Socket: No; SMD: Yes; Manufacturer1 Example: YAGEO PHYCOMP; Manufacturer1 ComponentHeight: 0.4mm; HelpURL: \\cern.ch\dfs\Applications\Altium\Datasheets\R0402_Phycomp_RC0402.pdf; Author: CERN DEM JLC; CreateDate: 03.12.2007; LatestRevisionDate: 17.10.2012
R5-R8 = R0402_49R9_1%_0.0625W_100PPM: Resistor - 1%; Part Description: General Purpose Thick Film Chip Resistor; Manufacturer: GENERIC; Manufacturer1 Part Number: 232270674999L or RC0402FR-0749R9L; TC: ±100ppm/°C; PressFit: No; Part Number: R0402_49R9_1%_0.0625W_100PPM; Component Kind: Standard; Component Type: Standard; Pin Count: 2; Value: 49R9; Status: Not Recommended; Power: 0.0625W; Tolerance: ±1%; Manufacturer Part Number: R0402_49R9_1%_0.0625W_100PPM; Case: 0402; Mounted: Yes; Sense: No; Socket: No; SMD: Yes; Manufacturer1 Example: YAGEO PHYCOMP; Manufacturer1 ComponentHeight: 0.4mm; HelpURL: \\cern.ch\dfs\Applications\Altium\Datasheets\R0402_Phycomp_RC0402.pdf; Author: CERN DEM JLC; CreateDate: 24.10.2012; LatestRevisionDate: 24.10.2012
R9 R10 R13 R17 = R0402_33R_1%_0.0625W_100PPM: Resistor - 1%; Part Description: General Purpose Thick Film Chip Resistor; Manufacturer: GENERIC; Manufacturer1 Part Number: 232270673309L; TC: ±100ppm/°C; PressFit: No; Part Number: R0402_33R_1%_0.0625W_100PPM; Component Kind: Standard; Component Type: Standard; Pin Count: 2; Value: 33; Status: Not Recommended; Power: 0.0625W; Tolerance: ±1%; Manufacturer Part Number: R0402_33R_1%_0.0625W_100PPM; Case: 0402; Mounted: Yes; Sense: No; Socket: No; SMD: Yes; Manufacturer1 Example: YAGEO PHYCOMP; Manufacturer1 ComponentHeight: 0.4mm; HelpURL: \\cern.ch\dfs\Applications\Altium\Datasheets\R0402_Phycomp_RC0402.pdf; Author: CERN DEM JLC; CreateDate: 03.12.2007; LatestRevisionDate: 17.10.2012
R12 = R0402_12K1_1%_0.0625W_100PPM: Resistor - 1%; Part Description: General Purpose Thick Film Chip Resistor; Manufacturer: GENERIC; Manufacturer1 Part Number: 232270671213L or RC0402FR-0712K1L; TC: ±100ppm/°C; PressFit: No; Part Number: R0402_12K1_1%_0.0625W_100PPM; Component Kind: Standard; Component Type: Standard; Pin Count: 2; Value: 12k1; Status: Not Recommended; Power: 0.0625W; Tolerance: ±1%; Manufacturer Part Number: R0402_12K1_1%_0.0625W_100PPM; Case: 0402; Mounted: Yes; Sense: No; Socket: No; SMD: Yes; Manufacturer1 Example: YAGEO PHYCOMP; Manufacturer1 ComponentHeight: 0.4mm; HelpURL: \\cern.ch\dfs\Applications\Altium\Datasheets\R0402_Phycomp_RC0402.pdf; Author: CERN DEM JLC; CreateDate: 24.10.2012; LatestRevisionDate: 24.10.2012
R14 = R0402_1K5_1%_0.0625W_100PPM: Resistor - 1%; Part Description: General Purpose Thick Film Chip Resistor; Manufacturer: GENERIC; Manufacturer1 Part Number: 232270671502L; TC: ±100ppm/°C; PressFit: No; Part Number: R0402_1K5_1%_0.0625W_100PPM; Component Kind: Standard; Component Type: Standard; Pin Count: 2; Value: 1k5; Status: Not Recommended; Power: 0.0625W; Tolerance: ±1%; Manufacturer Part Number: R0402_1K5_1%_0.0625W_100PPM; Case: 0402; Mounted: Yes; Sense: No; Socket: No; SMD: Yes; Manufacturer1 Example: YAGEO PHYCOMP; Manufacturer1 ComponentHeight: 0.4mm; HelpURL: \\cern.ch\dfs\Applications\Altium\Datasheets\R0402_Phycomp_RC0402.pdf; Author: CERN DEM JLC; CreateDate: 03.12.2007; LatestRevisionDate: 17.10.2012
U1 = LAN8742A-CZ-TR: LAN8742A-CZ-TR - Small Footprint RMII 10/100 Ethernet, Transceiver with HP Auto-MDIX and flexPWR Technology SQFN-24; Manuf_1: MICROCHIP; Order: LAN8742A-CZ-TR; Manuf_Part_1: LAN8742A-CZ-TR; Distrib: MICROCHIP